# EAGLE design rapidshark-main-breakout-top-mk-1.6 (EAGLE 6.5.0)
AUTHOR: sean@yak.net
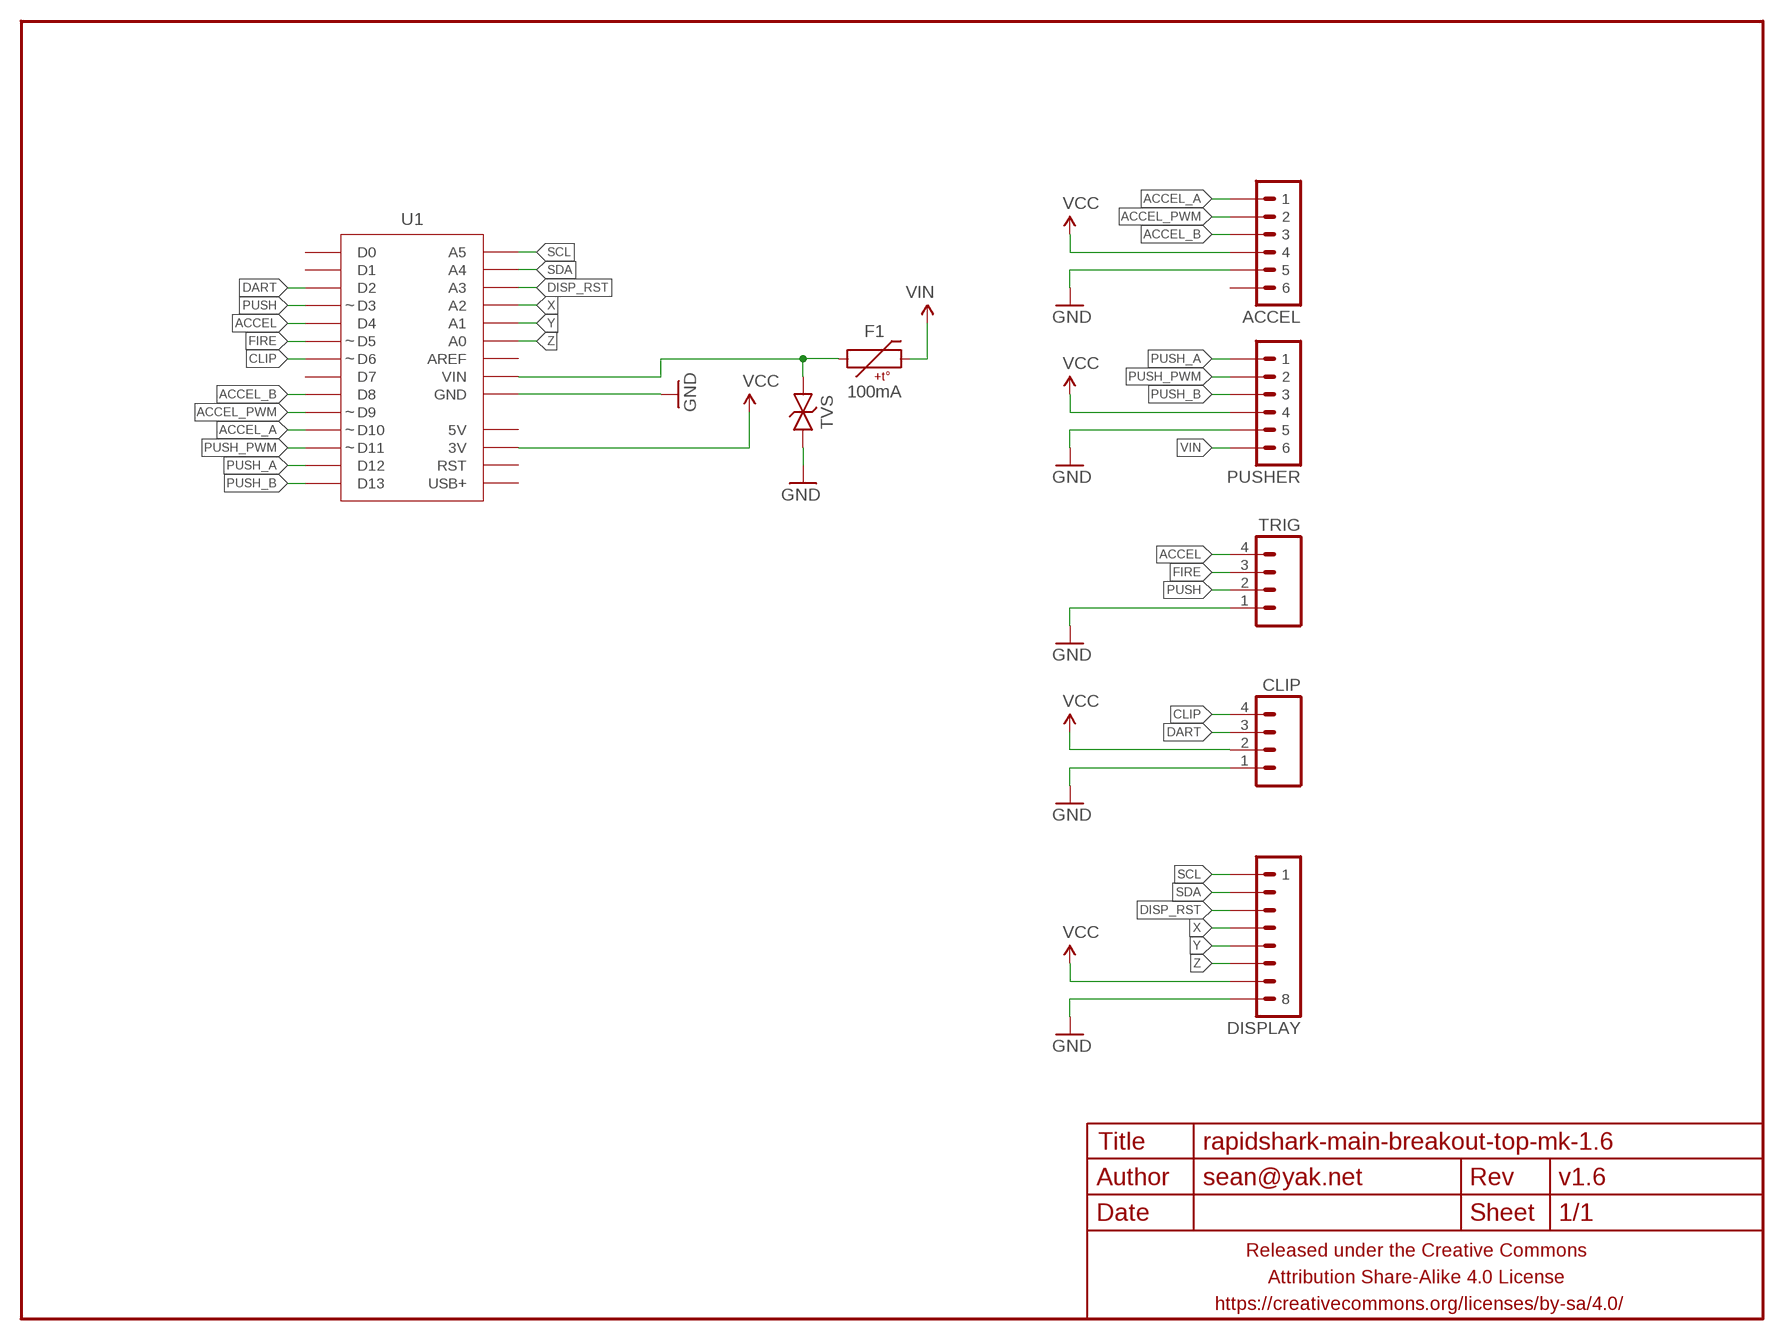
[diagram p0: schematic, sheet 1]

## Parts
ACCEL  M06JST-PH-PTH-VERT  [JST-6-PH-VERT-PTH]
CLIP  M04JST-PTH-VERT  [JST-4-PH-VERT-PTH]
DISPLAY  M08JST-PH-VERT-PTH  [JST-8-VERT-PTH]
F1  100mA  PTCSMD  [PTC-1206]
FRAME1  FRAME-LETTERNO_PACKAGE  [DUMMY]
PUSHER  M06JST-PH-PTH-VERT  [JST-6-PH-VERT-PTH]
TRIG  M04JST-PTH-VERT  [JST-4-PH-VERT-PTH]
TVS  TVSSMA  [SMA-DIODE-TVS-BIDIR]
U1  ADAFRUIT_METRO_MININOSILK-AMBI2  [ADAFRUIT_METRO_MINI_BACK]

## Nets
ACCEL: TRIG.4 U1.5(D4)
ACCEL_A: ACCEL.1 U1.11(D10)
ACCEL_B: ACCEL.3 U1.9(D8)
ACCEL_PWM: ACCEL.2 U1.10(D9)
CLIP: CLIP.4 U1.7(D6)
DART: CLIP.3 U1.3(D2)
DISP_RST: DISPLAY.3 U1.26(A3)
FIRE: TRIG.3 U1.6(D5)
GND: ACCEL.5 CLIP.1 DISPLAY.8 PUSHER.5 TRIG.1 TVS.1 U1.19(GND) U1.20(GND)
N$1: F1.1 TVS.2 U1.21(VIN)
PUSH: TRIG.2 U1.4(D3)
PUSH_A: PUSHER.1 U1.13(D12)
PUSH_B: PUSHER.3 U1.14(D13)
PUSH_PWM: PUSHER.2 U1.12(D11)
SCL: DISPLAY.1 U1.28(A5)
SDA: DISPLAY.2 U1.27(A4)
VCC: ACCEL.4 CLIP.2 DISPLAY.7 PUSHER.4 U1.17(3V)
VIN: F1.2 PUSHER.6
X: DISPLAY.4 U1.25(A2)
Y: DISPLAY.5 U1.24(A1)
Z: DISPLAY.6 U1.23(A0)
Unconnected: ACCEL.6 U1.1(D0) U1.2(D1) U1.8(D7) U1.15(USB+) U1.16(RST) U1.18(5V) U1.22(AREF)

## Library data of the parts
ACCEL PUSHER = A_butts:M06: Header 6 Standard 6-pin 0.1" header. Use with straight break away headers (SKU : PRT-00116), right angle break away headers (PRT-00553), swiss pins (PRT-00743), machine pins (PRT-00117), and female headers (PRT-00115). Molex polarized connector foot print use with SKU : PRT-08094 with associated crimp pins and housings. NOTES ON THE VARIANTS LOCK and LOCK_LONGPADS... This footprint was designed to help hold the alignment of a through-hole component (i.e. 6-pin header) while soldering it into place. You may notice that each hole has been shifted either up or down by 0.005 of an inch from it's more standard position (which is a perfectly straight line). This slight alteration caused the pins (the squares in the middle) to touch the edges of the holes. Because they are alternating, it causes a "brace" to hold the component in place. 0.005 has proven to be the perfect amount of "off-center" position when using our standard breakaway headers. Although looks a little odd when you look at the bare footprint, once you have a header in there, the alteration is very hard to notice. Also,if you push a header all the way into place, it is covered up entirely on the bottom side. This idea of altering the position of holes to aid alignment will be further integrated into the Sparkfun Library for other footprints. It can help hold any component with 3 or more connection pins.
CLIP TRIG = A_butts:M04: Header 4 Standard 4-pin 0.1" header. Use with straight break away headers (SKU : PRT-00116), right angle break away headers (PRT-00553), swiss pins (PRT-00743), machine pins (PRT-00117), and female headers (PRT-00115). Molex polarized connector foot print use with SKU : PRT-08231 with associated crimp pins and housings. 1MM SMD Version SKU: PRT-10208
DISPLAY = A_butts:M08: Header 8 Standard 8-pin 0.1" header. Use with straight break away headers (SKU : PRT-00116), right angle break away headers (PRT-00553), swiss pins (PRT-00743), machine pins (PRT-00117), and female headers (PRT-00115).
F1 = A_butts:PTC: Resettable Fuse PTC Resettable Fuse. Spark Fun Electronics SKU : COM-08357; PROD_ID: RES-11150
FRAME1 = A_butts:FRAME-LETTER: Schematic Frame Standard 8.5x11 US Letter frame; DESIGNER: sean@yak.net; VERSION: v1.6
TVS = A_butts:TVS: Transient voltage suppressor- prevents ESD on inputs. Ignore package description- MBRA140 is NOT this type of part!!!
U1 = A_butts:ADAFRUIT_METRO_MINI

## Board
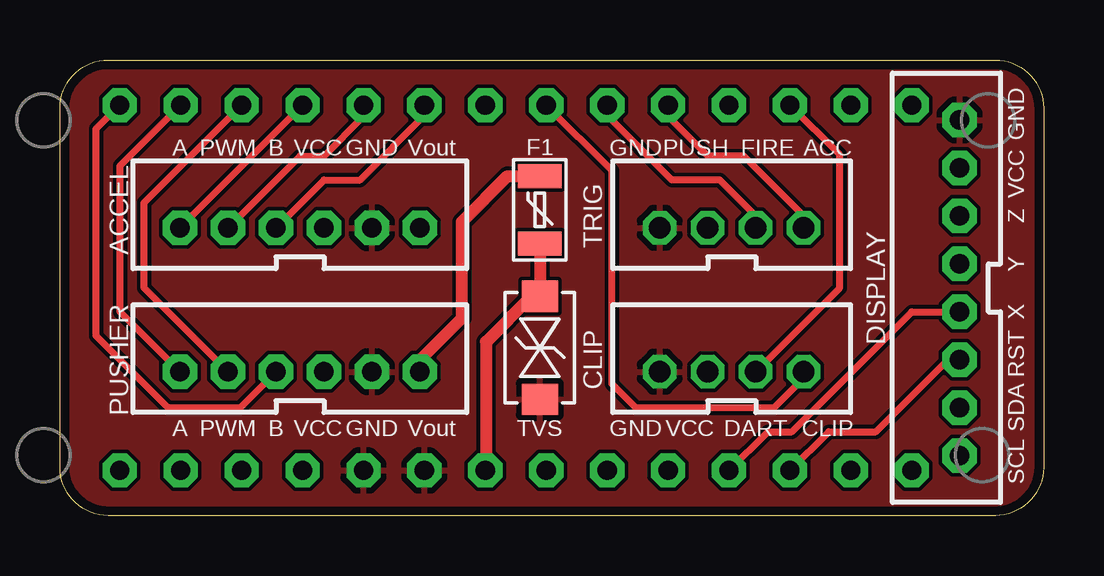
[diagram p1: board, top side]
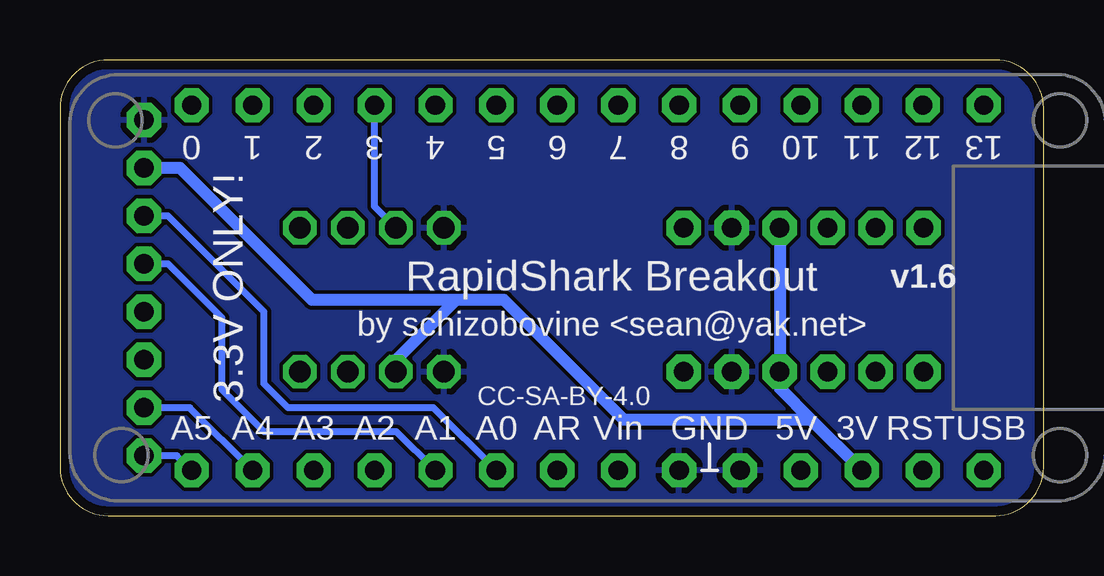
[diagram p2: board, bottom side, seen from below]

Size 41 x 19 mm. Coordinates in mm from the lower left corner, seen from the top.
Outline: 0,2 0,17 arc-90 2,19 39,19 arc-90 41,17 41,2 arc-90 39,0 2,0 arc-90 0,2
Copper layers (1*16): Top 0.0356mm / dielectric 1.5011mm / Bottom 0.0356mm
Design rules "LaenPCBOrder_2": minimum track width 6mil, minimum drill 13mil, track to track 6mil, track to pad 6mil, pad to pad 6mil, via to via 6mil, smd to smd 6mil, copper to edge 15mil, drill to drill 6mil, minimum pad ring 7mil, minimum via ring 7mil, stop-mask expansion 3mil, vias tented up to drill 20mil, thermal gap 10mil

### Footprints (pad centres in the part's own frame; a part is rotated, then mirrored left to right if it is on the bottom)
JST-6-PH-VERT-PTH = drill 0.8 pad 1.422 octagon: 1 -5,0; 2 -3,0; 3 -1,0; 4 1,0; 5 3,0; 6 5,0
JST-4-PH-VERT-PTH = drill 0.9 pad 1.4 octagon: 1 0,0; 2 2,0; 3 4,0; 4 6,0
JST-8-VERT-PTH = drill 0.8 pad 1.422 octagon: 1 -7,0; 2 -5,0; 3 -3,0; 4 -1,0; 5 1,0; 6 3,0; 7 5,0; 8 7,0
PTC-1206 = smd 1 x 1.8: 1 -1.4,0; 2 1.4,0
SMA-DIODE-TVS-BIDIR = smd 1.3 x 1.5: 1 -2.15,0; 2 2.15,0
ADAFRUIT_METRO_MINI_BACK = drill 0.8 pad 1.422 octagon: 1 16.51,7.62; 2 13.97,7.62; 3 11.43,7.62; 4 8.89,7.62; 5 6.35,7.62; 6 3.81,7.62; 7 1.27,7.62; 8 -1.27,7.62; 9 -3.81,7.62; 10 -6.35,7.62; 11 -8.89,7.62; 12 -11.43,7.62; 13 -13.97,7.62; 14 -16.51,7.62; 15 -16.51,-7.62; 16 -13.97,-7.62; 17 -11.43,-7.62; 18 -8.89,-7.62; 19 -6.35,-7.62; 20 -3.81,-7.62; 21 -1.27,-7.62; 22 1.27,-7.62; 23 3.81,-7.62; 24 6.35,-7.62; 25 8.89,-7.62; 26 11.43,-7.62; 27 13.97,-7.62; 28 16.51,-7.62

### Placement (x,y rotation side)
ACCEL  10,12 0 top
CLIP  25,6 0 top
DISPLAY  37.5,9.5 90 top
F1  20,12.75 90 top
FRAME1  0,0 270 bottom
PUSHER  10,6 0 top
TRIG  25,12 0 top
TVS  20,7 90 top
U1  19,9.5 0 top

### Tracks (layer width: path | path; a pad name or v marks a point on that pad's centre or on a via)
ACCEL
  Top 0.3: TRIG.4 31,12.5 28.5,15 27,15 25.35,16.65 U1.5
ACCEL_A
  Top 0.3: ACCEL.1 U1.11
ACCEL_B
  Top 0.3: ACCEL.3 11,14 12.5,14 15.19,16.69 U1.9
ACCEL_PWM
  Top 0.3: ACCEL.2 10,15 11,15 12.65,16.65 U1.10
CLIP
  Top 0.3: CLIP.4 31,5.75 29.75,4.5 24,4.5 23,5.5 23,14.39 U1.7
DART
  Top 0.3: CLIP.3 32.5,9.5 32.5,15.05 U1.3
DISP_RST
  Top 0.3: U1.26 32.05,3.5 34,3.5 37,6.5 DISPLAY.3
FIRE
  Top 0.3: TRIG.3 29,12.5 27.5,14 25.5,14 22.81,16.69 U1.6
GND
  pour Top (rank 6): 41,0 0,0 0,19 41,19
  pour Bottom (rank 6): 41,0 0,0 0,19 41,19
N$1
  Top 0.5: F1.1 TVS.2 19.65,9.15 17.75,7.25 17.75,1.9 U1.21
PUSH
  Bottom 0.3: TRIG.2 27.89,12.89 U1.4
PUSH_A
  Top 0.3: PUSHER.1 2.5,8.5 2.5,14.59 U1.13
PUSH_B
  Top 0.3: PUSHER.3 7.5,4.5 4.5,4.5 1.5,7.5 1.5,16.13 U1.14
PUSH_PWM
  Top 0.3: PUSHER.2 3.5,9.5 3.5,13.05 U1.12
SCL
  Bottom 0.3: U1.28 36.13,2.5 DISPLAY.1
SDA
  Bottom 0.3: U1.27 35.59,4.5 DISPLAY.2
VCC
  Bottom 0.5: U1.17 9.69,4 | 9.69,4 17.5,4 22.5,9 24.5,9 | 24.5,9 30.5,9 36,14.5 DISPLAY.7 | CLIP.2 27,6.5 24.5,9 | 9.69,4 11,5.31 PUSHER.4 ACCEL.4
VIN
  Top 0.5: F1.2 18.65,14.15 16.75,12.25 16.75,8.25 15,6.5 PUSHER.6
X
  Top 0.3: U1.25 29.51,3.5 30.5,3.5 35.5,8.5 DISPLAY.4
Y
  Bottom 0.3: U1.24 26.97,3.5 32.5,3.5 34.25,5.25 34.25,8.25 36.5,10.5 DISPLAY.5
Z
  Bottom 0.3: U1.23 25.43,4.5 31.5,4.5 32.5,5.5 32.5,8.5 36.5,12.5 DISPLAY.6

### Text on the board
tPlace: GND | A | PWM | B | VCC | GND | Vout | GND | PUSH | FIRE | ACC | VCC | Z | Y | X | RST | A | PWM | B | VCC | GND | Vout | GND | VCC | DART | CLIP | SDA | SCL
bPlace: RapidShark Breakout | 3.3V ONLY! | by schizobovine <sean@yak.net> | CC-SA-BY-4.0